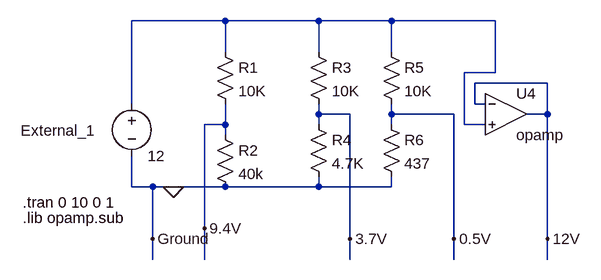
[diagram p0: schematic PowerSupplyDesign.asc]
PowerSupplyDesign.asc, the LTspice schematic file:
Version 4
SHEET 1 880 680
WIRE -320 -32 -464 -32
WIRE -176 -32 -320 -32
WIRE -64 -32 -176 -32
WIRE 96 -32 -64 -32
WIRE -320 16 -320 -32
WIRE -176 16 -176 -32
WIRE -64 16 -64 -32
WIRE 96 48 96 -32
WIRE 96 48 48 48
WIRE 176 64 64 64
WIRE -464 96 -464 -32
WIRE 64 96 64 64
WIRE 80 96 64 96
WIRE -176 112 -176 96
WIRE -128 112 -176 112
WIRE -64 112 -64 96
WIRE 32 112 -64 112
WIRE 176 112 176 64
WIRE 176 112 144 112
WIRE -320 128 -320 96
WIRE -320 128 -352 128
WIRE -176 128 -176 112
WIRE -64 128 -64 112
WIRE 48 128 48 48
WIRE 80 128 48 128
WIRE -320 144 -320 128
WIRE -464 224 -464 176
WIRE -432 224 -464 224
WIRE -400 224 -432 224
WIRE -320 224 -400 224
WIRE -176 224 -176 208
WIRE -176 224 -320 224
WIRE -64 224 -64 208
WIRE -64 224 -176 224
WIRE -352 288 -352 128
WIRE -432 304 -432 224
WIRE -128 304 -128 112
WIRE 32 304 32 112
WIRE 176 304 176 112
WIRE -432 336 -432 304
WIRE -352 336 -352 288
WIRE -128 336 -128 304
WIRE 32 336 32 304
WIRE 176 336 176 304
FLAG -400 224 0
FLAG 32 304 0.5V
FLAG -128 304 3.7V
FLAG -352 288 9.4V
FLAG -432 304 Ground
FLAG 176 304 12V
SYMBOL voltage -464 80 R0
WINDOW 0 -171 57 Left 2
SYMATTR InstName External_1
SYMATTR Value 12
SYMBOL res -336 0 R0
SYMATTR InstName R1
SYMATTR Value 10K
SYMBOL res -336 128 R0
SYMATTR InstName R2
SYMATTR Value 40k
SYMBOL res -192 0 R0
SYMATTR InstName R3
SYMATTR Value 10K
SYMBOL res -192 112 R0
SYMATTR InstName R4
SYMATTR Value 4.7K
SYMBOL res -80 0 R0
SYMATTR InstName R5
SYMATTR Value 10K
SYMBOL res -80 112 R0
SYMATTR InstName R6
SYMATTR Value 437
SYMBOL OpAmps\\opamp 112 48 R0
SYMATTR InstName U4
TEXT -632 248 Left 2 !.tran 0 10 0 1
TEXT -632 272 Left 2 !.lib opamp.sub

The netlist it stands for:
* PowerSupplyDesign.asc
V§External_1 N001 0 12
R1 N001 9.4V 10K
R2 9.4V 0 40k
R3 N001 3.7V 10K
R4 3.7V 0 4.7K
R5 N001 0.5V 10K
R6 0.5V 0 437
XU4 12V N001 12V opamp Aol=100K GBW=10Meg  ; pins invin noninvin out
.tran 0 10 0 1
.lib opamp.sub
.backanno
.end